# EAGLE design PiHome RFM69-95 to nRF (EAGLE 9.5.2)
PiHome - Smart Heating, Ventilation and Air Conditioning (HVAC) nRF24L01 to RFM69CW/RFM69HCW/RFM69W/ Adapter compatible with MySensors Library Size/Compatibility RFM69CW/RFM69HCW/RFM69W For more information check PiHome website http://www.pihome.eu <@http://www.pihome.eu@>
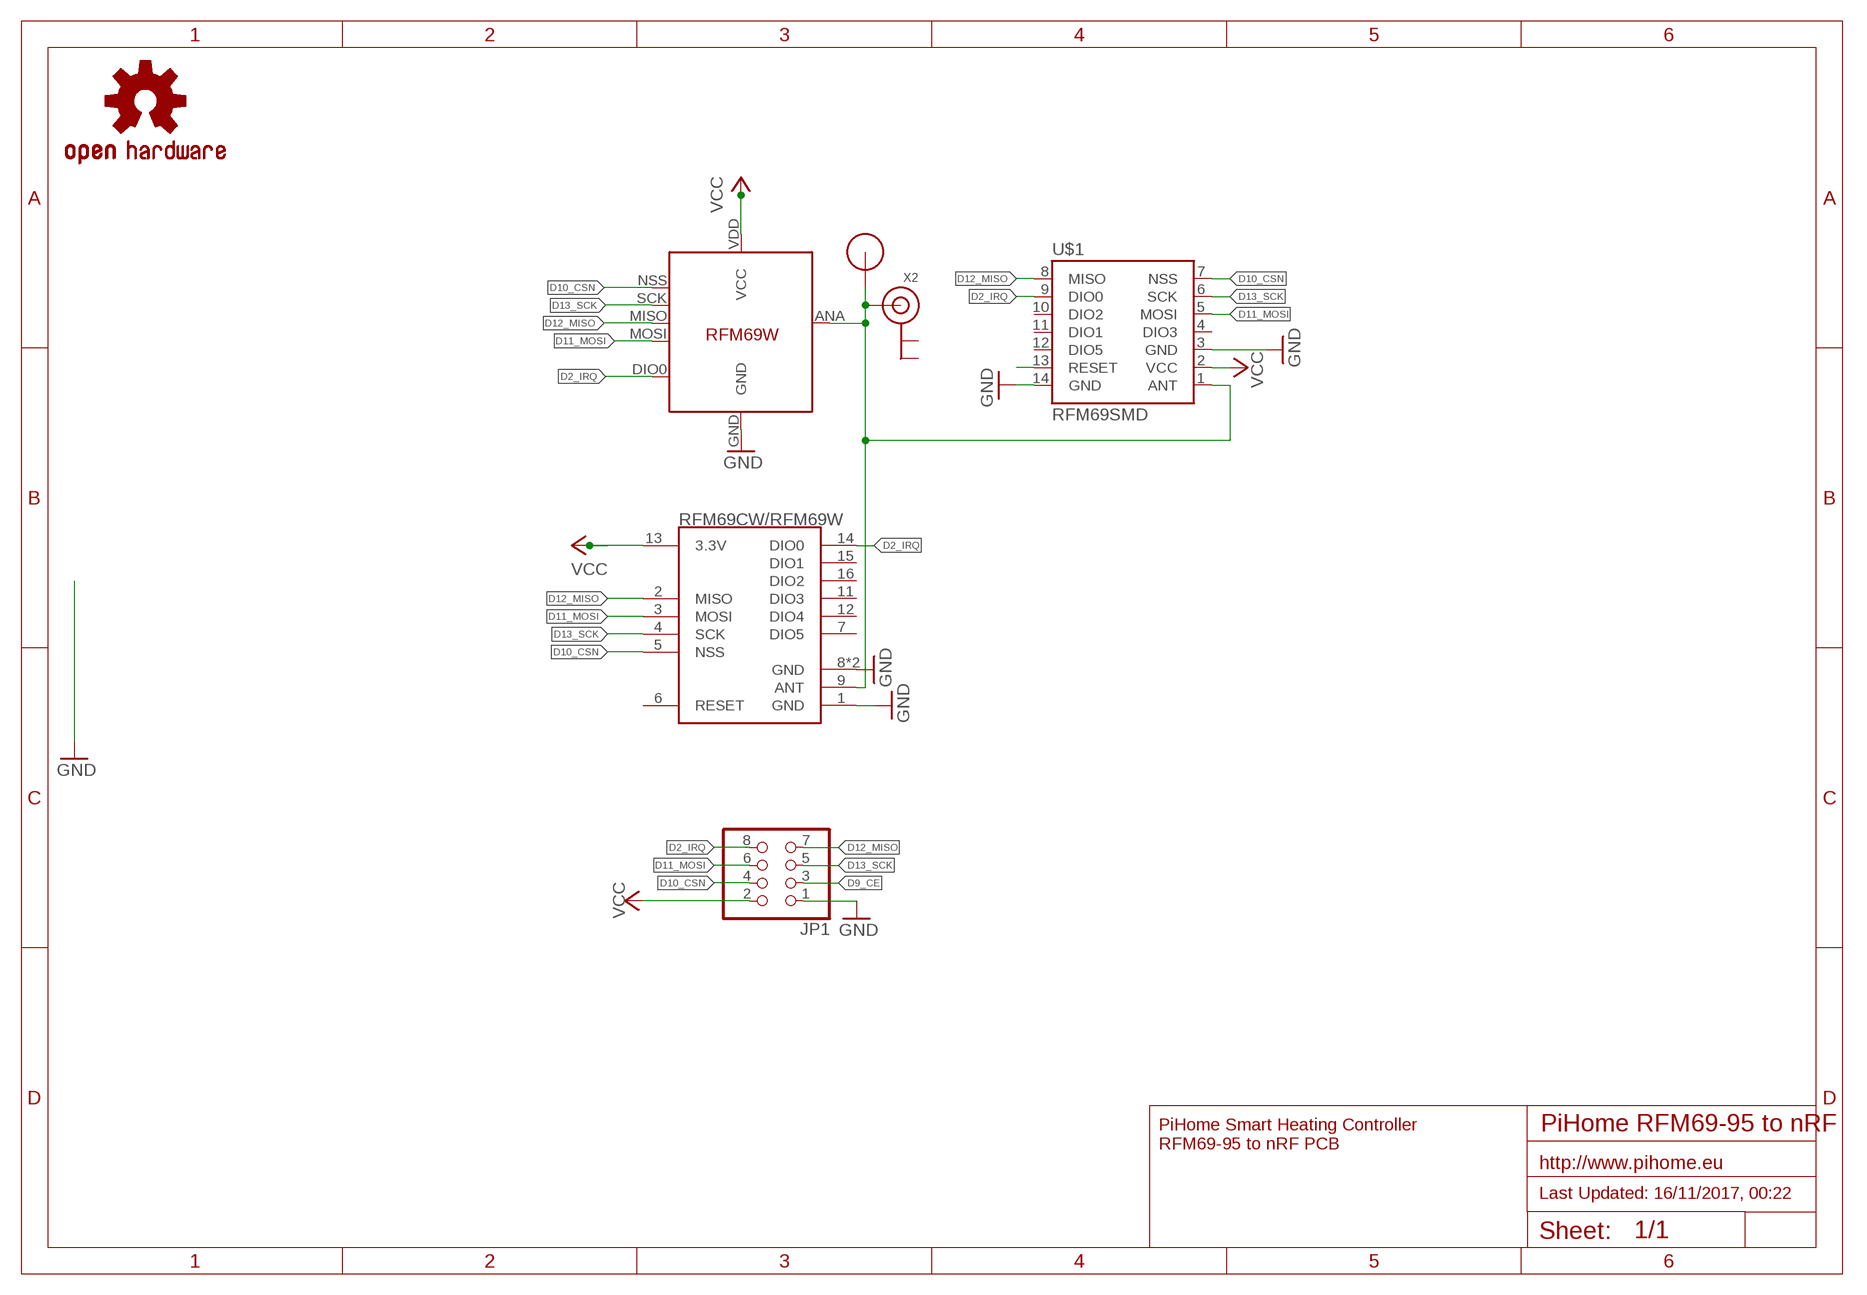
[diagram p0: schematic, sheet 1]

## Parts
JP1  PINHD-2X4  [2X04]
LOGO2  OSHW-LOGOS  [OSHW-LOGO-S]
RFM69CW/RFM69W  RFM69HCW  [RFM69HCW-XXXS2]
RFM69W-433MHZ  RFM69  [RFM69W-MINPADS]
U$1  RFM69SMD  [RFM69]
U$6  RFM12B_ANTENNA  [RFM12B-ANTENNA]
X2  ANTENNA_U.FL  [U.FL]

## Nets
D2_IRQ: JP1.8 RFM69CW/RFM69W.14(DIO0) RFM69W-433MHZ.DIO0 U$1.9(DIO0)
D9_CE: JP1.3
D10_CSN: JP1.4 RFM69CW/RFM69W.5(NSS) RFM69W-433MHZ.NSS(SEL) U$1.7(NSS)
D11_MOSI: JP1.6 RFM69CW/RFM69W.3(MOSI) RFM69W-433MHZ.MOSI U$1.5(MOSI)
D12_MISO: JP1.7 RFM69CW/RFM69W.2(MISO) RFM69W-433MHZ.MISO U$1.8(MISO)
D13_SCK: JP1.5 RFM69CW/RFM69W.4(SCK) RFM69W-433MHZ.SCK U$1.6(SCK)
GND: JP1.1 RFM69CW/RFM69W.1(GND) RFM69CW/RFM69W.8(GND) RFM69CW/RFM69W.10(GND) RFM69W-433MHZ.GND U$1.3(GND) U$1.14(GND)
N$3: RFM69CW/RFM69W.9(ANT) RFM69W-433MHZ.ANA(ANT) U$1.1(ANT) U$6.P$1 X2.3(SIGNAL)
N$12: U$1.13(RESET)
VCC: JP1.2 RFM69CW/RFM69W.13(3.3V) RFM69W-433MHZ.VDD(VCC) U$1.2(VCC)
Unconnected: RFM69CW/RFM69W.6(RESET) RFM69CW/RFM69W.7(DIO5) RFM69CW/RFM69W.11(DIO3) RFM69CW/RFM69W.12(DIO4) RFM69CW/RFM69W.15(DIO1) RFM69CW/RFM69W.16(DIO2) U$1.4(DIO3) U$1.10(DIO2) U$1.11(DIO1) U$1.12(DIO5) X2.1(GND) X2.2(GND)

## Notes on the sheet
- PiHome Smart Heating Controller
  RFM69-95 to nRF PCB
- http://www.pihome.eu
- Last Updated: 16/11/2017, 00:22

## Library data of the parts
JP1 = adafruit:PINHD-2X4: PIN HEADER
LOGO2 = SparkFun-Aesthetics:OSHW-LOGO: Open Source Hardware Logo This logo indicates the piece of hardware it is found on incorporates a OSHW license and/or adheres to the definition of open source hardware found here: http://freedomdefined.org/OSHW
RFM69CW/RFM69W = SparkFun-RF:RFM69H; PROD_ID: IC-11997, IC-12053
RFM69W-433MHZ = LowPowerLab:RFM69
U$1 = RFM69:RFM69: The RFM22 is a low-power, low cost radio that is capable of operating in the 434MHz and 900MHz open bands. It's frequency is software defined and there are some very good libraries written for it.
U$6 = LowPowerLab:RFM12B_ANTENNA
X2 = adafruit:ANTENNA_U.FL: U.FL Antenna Connector

## Net classes
0 default: width 0.254 mm, drill 0.076 mm, clearance 0.178 mm
1 vcc: width 0.254 mm

## Board
PiHome - Smart Heating, Ventilation and Air Conditioning (HVAC) nRF24L01 to RFM69CW/RFM69HCW/RFM69W/ Adapter compatible with MySensors Library Size/Compatibility RFM69CW/RFM69HCW/RFM69W For more information check PiHome website http://www.pihome.eu
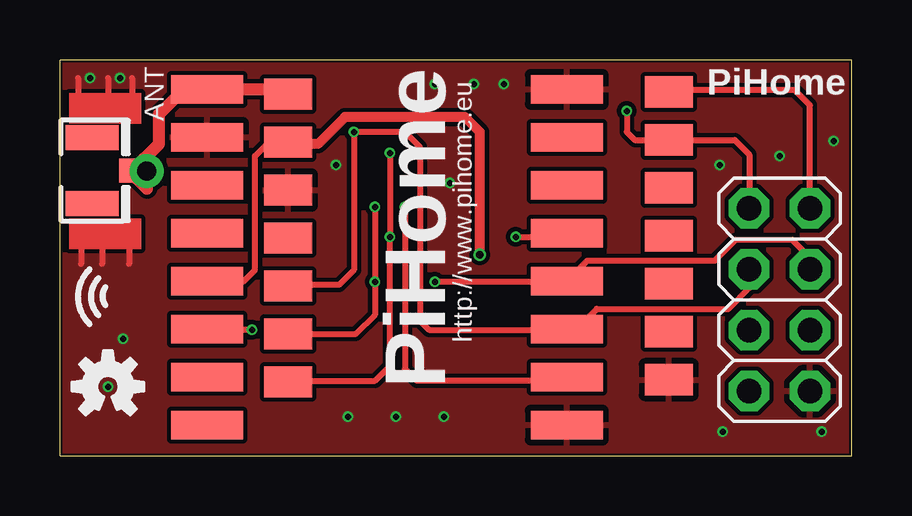
[diagram p1: board, top side]
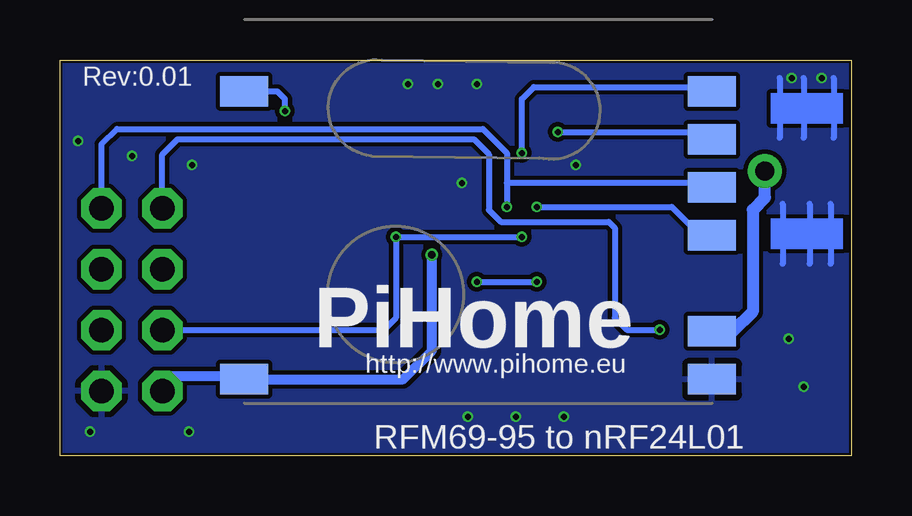
[diagram p2: board, bottom side, seen from below]

Size 33 x 16.5 mm. Coordinates in mm from the lower left corner, seen from the top.
Outline: 0,0 33,0 33,16.5 0,16.5 0,0
Copper layers (1*16): Top 0.035mm / dielectric 0.2mm / Bottom 0.035mm
Design rules "jlcpcb-2-layer": minimum track width 3.5mil, minimum drill 0.2mm, track to track 3.5mil, track to pad 5mil, pad to pad 5mil, via to via 5mil, smd to smd 0mil, copper to edge 0.1mm, drill to drill 5mil, minimum pad ring 4mil, minimum via ring 4mil, stop-mask expansion 3mil, vias tented up to drill 100mil, thermal gap 10mil

### Footprints (pad centres in the part's own frame; a part is rotated, then mirrored left to right if it is on the bottom)
2X04 = drill 1.016 pad 1.676 octagon: 1 -3.81,-1.27; 2 -3.81,1.27; 3 -1.27,-1.27; 4 -1.27,1.27; 5 1.27,-1.27; 6 1.27,1.27; 7 3.81,-1.27; 8 3.81,1.27
RFM69HCW-XXXS2 = smd 3 x 1.2: 1 -7.5,7; 2 -7.5,5; 3 -7.5,3; 4 -7.5,1; 5 -7.5,-1; 6 -7.5,-3; 7 -7.5,-5; 8 -7.5,-7; 9 7.5,-7; 10 7.5,-5; 11 7.5,-3; 12 7.5,-1; 13 7.5,1; 14 7.5,3; 15 7.5,5; 16 7.5,7
RFM69W-MINPADS = smd 2 x 1.27: ANA 8,-5; DIO0 -11.5,5; GND 8,-7; MISO 8,1; MOSI 8,3; NSS 8,5; SCK 8,-1; VDD -11.5,-7
RFM69 = smd 2 x 1.3: 1 8,-6.27; 2 8,-4.27; 3 8,-2.27; 4 8,-0.27; 5 8,1.73; 6 8,3.73; 7 8,5.73; 8 -7.875,-6.365; 9 -7.875,-4.365; 10 -7.875,-2.365; 11 -7.875,-0.365; 12 -7.875,1.635; 13 -7.875,3.635; 14 -7.875,5.635
RFM12B-ANTENNA = drill 0.8 pad 1.422: P$1 0,0
U.FL = smd 2.2 x 1.05: 1 0,1.375; 2 0,-1.375 | smd 0.8 x 1: 3 1.525,0

### Placement (x,y rotation side)
JP1  30,6.5 90 top
LOGO2  2,2.88 0 top
RFM69CW/RFM69W  13.62,8.28 180 top
RFM69W-433MHZ  13.81,10.19 0 bottom
U$1  17.5,8.8 180 top
U$6  3.61,11.86 180 top
X2  1.35,11.89 0 top

### Tracks (layer width: path | path; a pad name or v marks a point on that pad's centre or on a via)
D2_IRQ  (via drill 0.25)
  Top 0.254: JP1.8 28.73,12.56 28.12,13.16 U$1.9 23.96,13.16 23.62,13.5 v23.62,14.38 | v8,5.25 6.15,5.25 RFM69CW/RFM69W.14
  Bottom 0.254: v8,5.25 9.38,5.25 9.88,5.75 9.88,9.5 10.12,9.75 14.62,9.75 15.12,10.25 15.12,12.57 15.75,13.19 28.1,13.19 28.73,12.56 JP1.8 | v23.62,14.38 23.62,14.88 23.94,15.19 RFM69W-433MHZ.DIO0
D10_CSN  (via drill 0.25)
  Top 0.254: v19,9.12 21.12,9.12 RFM69CW/RFM69W.5 | v13.75,12.62 v13.75,9.12 13.75,3.75 13.12,3.12 9.5,3.12 U$1.7
  Bottom 0.254: JP1.4 28.71,5.25 19.5,5.25 19,5.75 v19,9.12 v13.75,9.12 | v13.75,12.62 13.75,14.88 13.25,15.38 6,15.38 RFM69W-433MHZ.NSS
D11_MOSI  (via drill 0.25)
  Top 0.254: U$1.5 9.5,7.12 11.62,7.12 12.25,7.75 v12.25,13.5 14.38,13.5 15,12.88 15,5.62 15.38,5.25 21.12,5.25 RFM69CW/RFM69W.3 21.23,5.38 21.62,5.38 22.38,6.12 27.88,6.12 28.73,6.98 JP1.6
  Bottom 0.254: v12.25,13.5 6.13,13.5 RFM69W-433MHZ.MOSI
D12_MISO  (via drill 0.25)
  Top 0.254: v14.38,10.38 14.38,3.62 14.88,3.12 20.98,3.12 RFM69CW/RFM69W.2 | JP1.7 31.27,14.61 30.62,15.25 25.46,15.25 U$1.8
  Bottom 0.254: JP1.7 31.27,12.98 30.62,13.62 15.38,13.62 14.38,12.62 14.38,11.38 | 14.38,11.38 v14.38,10.38 | RFM69W-433MHZ.MISO 6,11.38 14.38,11.38
D13_SCK  (via drill 0.25)
  Top 0.254: 9.5,5.12 U$1.6 12.32,5.07 13.12,5.88 v13.12,7.25 v13.12,10.38 | JP1.5 31.27,8.27 30.54,9 28.17,9 27.29,8.12 21.98,8.12 RFM69CW/RFM69W.4 21.1,7.25 v15.62,7.25
  Bottom 0.254: v15.62,7.25 v13.12,7.25 | RFM69W-433MHZ.SCK 6.31,9.19 7.5,10.38 v13.12,10.38
GND  (via drill 0.25)
  Top 0.254: 1.75,9 1.75,8 | 0.88,9 0.88,8 | 2.88,9 2.88,8 | 2,15.75 2,14.75 | 0.75,15.75 0.75,14.75 | 3,15.75 3,14.75
  Bottom 0.254: 2.88,9 2.88,8 | 0.88,9 0.88,8 | 0.75,15.75 0.75,14.75 | 2,15.75 2,14.75 | 3,15.75 3,14.75 | 1.75,9 1.75,8 | 0.88,10.5 0.88,9.5 | 1.75,10.5 1.75,9.5 | 2.88,10.5 2.88,9.5 | 0.75,14.25 0.75,13.25 | 2,14.25 2,13.25 | 3,14.25 3,13.25
  other vias: 12,1.62 16,1.62 14,1.62 2.62,4.88 2,2.88 32.25,13.12 15.62,15.5 17.25,15.5 16.25,11.38 11.5,12.12 18.5,15.5 27.5,12.12 30,12.5 27.62,1 31.75,1 1.25,15.75 2.5,15.75
  pour Top: 0,0 0,16.5 33,16.5 33,0
  pour Bottom: 0,0 0,16.5 33,16.5 33,0
N$3
  Top 0.254: 9.5,15.12 U$1.1 | 2.88,11.88 X2.3
  Top 0.508: U$1.1 9.29,15.28 RFM69CW/RFM69W.9 6.1,15.25 5.12,15.25 4.12,14.25 4.12,13 3.01,11.89 X2.3 | X2.3 3.62,11.13 | X2.3 2.9,11.86 U$6.P$1
  Bottom 0.508: U$6.P$1 3.61,10.76 4.12,10.25 4.12,6 4.94,5.19 RFM69W-433MHZ.ANA
VCC  (via drill 0.3)
  Top 0.254: U$1.2 9.5,13 8.62,13 8.12,12.5 8.12,7.75 7.62,7.25 6.12,7.25 RFM69CW/RFM69W.13
  Top 0.406: 9.5,13 10.75,13 11.88,14.12 16.88,14.12 17.5,13.5 v17.5,8.38
  Bottom 0.406: JP1.2 28.73,2.94 28.36,3.31 25.44,3.31 RFM69W-433MHZ.VDD 18.69,3.19 17.5,4.38 v17.5,8.38
(copper drawn outside any net)
  shapes: Bottom area x2, Top area x2

### Text on the board
tPlace: ANT | PiHome | http://www.pihome.eu | PiHome
bPlace: Rev:0.01 | PiHome | http://www.pihome.eu | RFM69-95 to nRF24L01